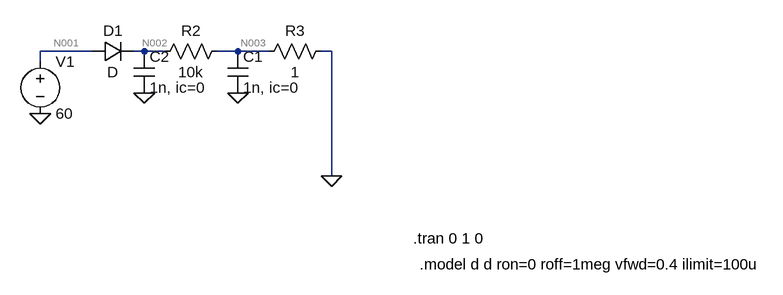
[diagram p0: schematic Draft2.asc]
Draft2.asc, the LTspice schematic file:
Version 4
SHEET 1 1468 680
WIRE 80 32 0 32
WIRE 160 32 144 32
WIRE 192 32 160 32
WIRE 304 32 272 32
WIRE 352 32 304 32
WIRE 448 32 432 32
WIRE 0 48 0 32
WIRE 448 224 448 32
FLAG 0 128 0
FLAG 448 224 0
FLAG 304 96 0
FLAG 160 96 0
SYMBOL voltage 0 32 R0
WINDOW 123 0 0 Left 0
WINDOW 39 0 0 Left 0
SYMATTR InstName V1
SYMATTR Value 60
SYMBOL diode 80 48 R270
WINDOW 0 32 32 VTop 2
WINDOW 3 0 32 VBottom 2
SYMATTR InstName D1
SYMBOL res 288 16 R90
WINDOW 0 0 56 VBottom 2
WINDOW 3 32 56 VTop 2
SYMATTR InstName R2
SYMATTR Value 10k
SYMBOL cap 288 32 R0
SYMATTR InstName C1
SYMATTR Value 1n, ic=0
SYMBOL res 448 16 R90
WINDOW 0 0 56 VBottom 2
WINDOW 3 32 56 VTop 2
SYMATTR InstName R3
SYMATTR Value 1
SYMBOL cap 144 32 R0
SYMATTR InstName C2
SYMATTR Value 1n, ic=0
TEXT 574 320 Left 2 !.tran 0 1 0
TEXT 584 360 Left 2 !.model d d ron=0 roff=1meg vfwd=0.4 ilimit=100u

The netlist it stands for:
* Draft2.asc
V1 N001 0 60
D1 N001 N002 D
R2 N003 N002 10k
C1 N003 0 1n, ic=0
R3 0 N003 1
C2 N002 0 1n, ic=0
.model D D
.lib standard.dio
.tran 0 1 0
.model d d ron=0 roff=1meg vfwd=0.4 ilimit=100u
.backanno
.end

* Results of the author's LTspice run, read from the files saved beside the schematic
* Operating Point, zero values left out:
*   V(n001) = 60 V
*   V(n002) = 100.4 nV
*   I(C2) = 100.4 µA
*   I(C1) = 10.03 pA
*   I(D1) = 100.4 µA
*   I(R2) = -10.04 pA
*   I(V1) = -100.4 µA
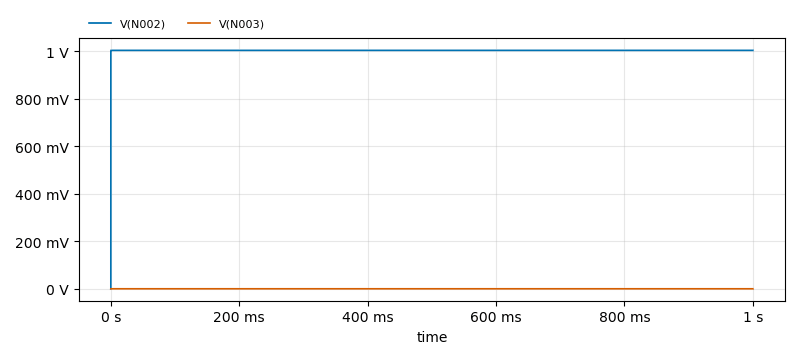
[diagram p1: Transient Analysis of Draft2.asc, plotted from the saved traces]
* Transient Analysis, 1 run:
*   V(N002): min 0 V, max 1.004 V, average 1.004 V, rms 1.004 V, last 1.004 V
*   V(N003): min 0 V, max 100.4 µV, average 100.4 µV, rms 100.4 µV, last 100.4 µV